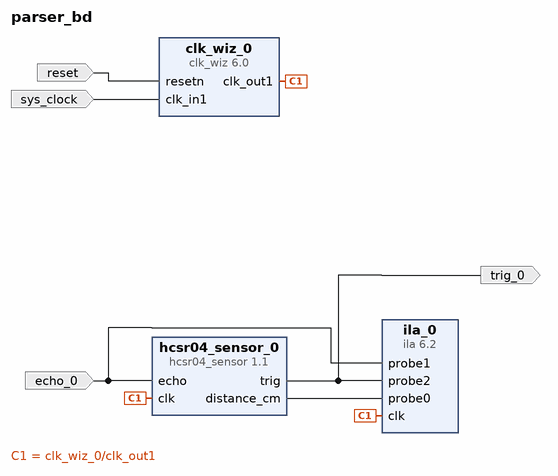
[diagram p0: block diagram of the top level]
# Vivado block design parser_bd, xc7a200tsbg484-1, Vivado 2018.3
create_bd_design parser_bd

create_bd_port -dir I echo_0
create_bd_port -dir O trig_0
create_bd_port -dir I -type rst reset
set_property -dict {CONFIG.POLARITY ACTIVE_LOW} [get_bd_ports reset]
create_bd_port -dir I -type clk sys_clock
set_property -dict {CONFIG.FREQ_HZ 100000000 CONFIG.PHASE 0.000} [get_bd_ports sys_clock]

create_bd_cell -type ip -vlnv xilinx.com:ip:clk_wiz:6.0 clk_wiz_0
set_property -dict [list \
  CONFIG.CLK_IN1_BOARD_INTERFACE sys_clock \
  CONFIG.RESET_BOARD_INTERFACE reset \
  CONFIG.RESET_PORT resetn \
  CONFIG.RESET_TYPE ACTIVE_LOW \
  CONFIG.USE_BOARD_FLOW true \
] [get_bd_cells clk_wiz_0]
create_bd_cell -type ip -vlnv xilinx.com:ip:ila:6.2 ila_0
set_property -dict [list \
  CONFIG.C_ENABLE_ILA_AXI_MON false \
  CONFIG.C_MONITOR_TYPE Native \
  CONFIG.C_NUM_OF_PROBES 3 \
  CONFIG.C_PROBE0_WIDTH 32 \
  CONFIG.C_TRIGIN_EN false \
] [get_bd_cells ila_0]
create_bd_cell -type ip -vlnv xilinx.com:user:hcsr04_sensor:1.1 hcsr04_sensor_0

# ---- connections ----

connect_bd_net [get_bd_pins clk_wiz_0/clk_out1] [get_bd_pins ila_0/clk] [get_bd_pins hcsr04_sensor_0/clk]
connect_bd_net -net echo_0_1 [get_bd_ports echo_0] [get_bd_pins ila_0/probe1] [get_bd_pins hcsr04_sensor_0/echo]
connect_bd_net [get_bd_pins hcsr04_sensor_0/trig] [get_bd_ports trig_0] [get_bd_pins ila_0/probe2]
connect_bd_net [get_bd_ports reset] [get_bd_pins clk_wiz_0/resetn]
connect_bd_net [get_bd_ports sys_clock] [get_bd_pins clk_wiz_0/clk_in1]
connect_bd_net [get_bd_pins hcsr04_sensor_0/distance_cm] [get_bd_pins ila_0/probe0]

validate_bd_design
save_bd_design
